# EAGLE schematic Teensy bboard (EAGLE 9.6.2)
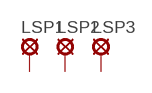
[diagram p0: schematic, sheet 1]

## Parts
LSP1  LSP10  [LSP10]
LSP2  LSP10  [LSP10]
LSP3  LSP10  [LSP10]
Unconnected: LSP1.MP LSP2.MP LSP3.MP

## Library data of the parts
LSP1-LSP3 = solpad:LSP10: SOLDER PAD drill 1.0 mm, distributor Buerklin, 12H555